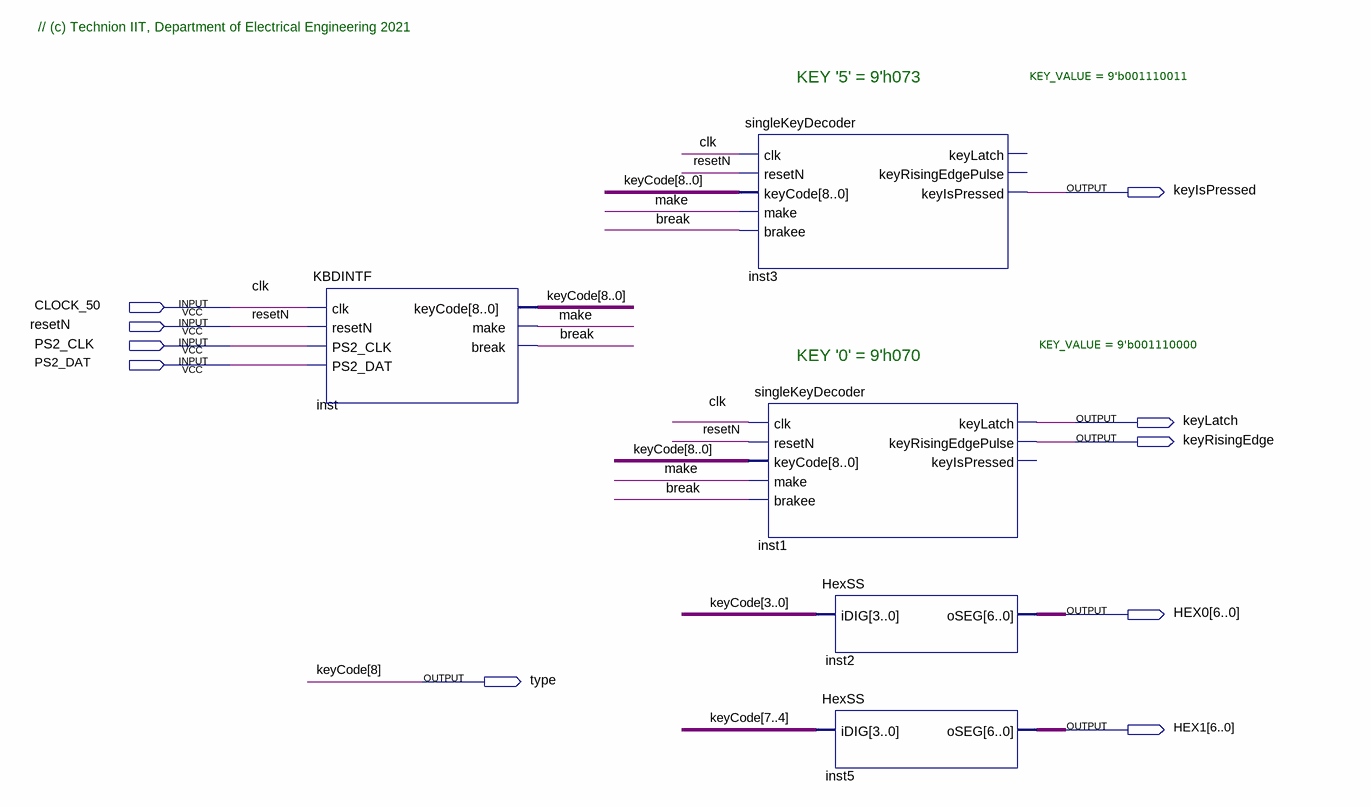
[diagram p0: schematic sheet]
// Quartus schematic TOP_KEYBOARD_DECODER.bdf as structural Verilog: 5 symbols, 10 pins
module TOP_KEYBOARD_DECODER (
  input  CLOCK_50,
  input  resetN,
  input  PS2_CLK,
  input  PS2_DAT,
  output keyIsPressed,
  output keyLatch,
  output keyRisingEdge,
  output [6:0] HEX0,
  output \type ,
  output [6:0] HEX1
);

  wire \break , make;
  wire [7:0] keyCode;

  KBDINTF inst (
    .clk(CLOCK_50), .resetN(resetN), .PS2_CLK(PS2_CLK), .PS2_DAT(PS2_DAT), .keyCode({\type , keyCode}),
    .make(make), .\break (\break ));
  singleKeyDecoder #(.KEY_VALUE(9'b001110011)) inst3 (
    .clk(CLOCK_50), .resetN(resetN), .keyCode({\type , keyCode}), .make(make), .brakee(\break ),
    .keyIsPressed(keyIsPressed));  // open: keyLatch, keyRisingEdgePulse
  singleKeyDecoder #(.KEY_VALUE(9'b001110000)) inst1 (
    .clk(CLOCK_50), .resetN(resetN), .keyCode({\type , keyCode}), .make(make), .brakee(\break ),
    .keyLatch(keyLatch), .keyRisingEdgePulse(keyRisingEdge));  // open: keyIsPressed
  HexSS inst2 (.iDIG(keyCode[3:0]), .oSEG(HEX0));
  HexSS inst5 (.iDIG(keyCode[7:4]), .oSEG(HEX1));

  // Other names for the same wires on the sheet: clk = CLOCK_50; keyCode[8] = \type 

  // Notes on the sheet:
  //   // (c) Technion IIT, Department of Electrical Engineering 2021 
  //   KEY '5' = 9'h073
  //   KEY '0' = 9'h070
endmodule
